# Altium project pca64142.PrjPCB
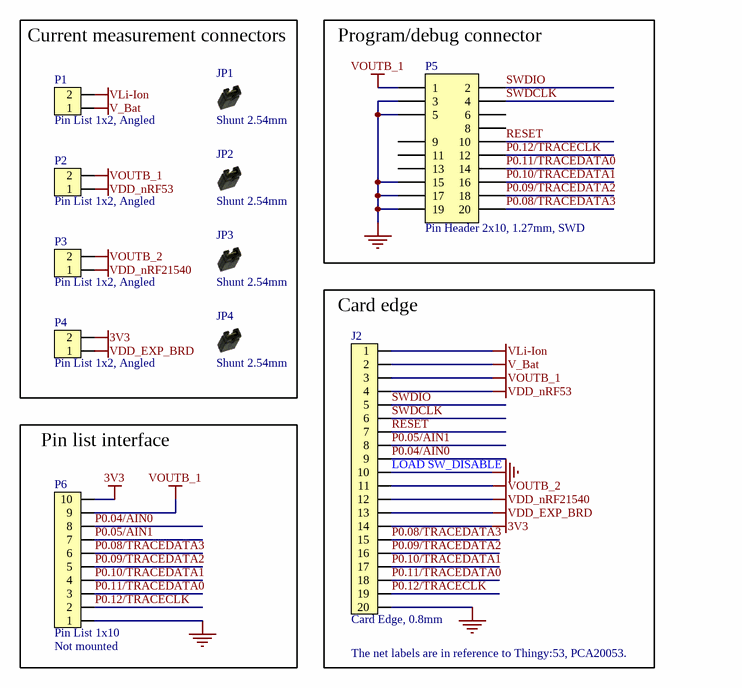
[diagram p0: pca64142.SchDoc]
SurfaceFinish: ENIG Gold; SoldermaskColor: Blue; SilkscreenColor: White; Revision: 1.0.1; ProjectNumber: PCA64142; ProjectName: Thingy:53; PCBStackup: 2004; PCBRevision: 0042MASI; PCBNumber: 400532; PCAName: PCA64142; Organization: Nordic Semiconductor; NrOfLayers: 2; LaminateMaterial: FR-4 Halogen Free; BoardTitle: Thingy53 Debug and Current Measurement Board; BoardThickness: 1.0mm; Author: MASI
1 sheet, 11 parts. Net scope: global (net labels, ports and power ports of the same name join across sheets).
Board file: 400532.PcbDoc

## Sheet pca64142.SchDoc: =BoardTitle
size A4; Organization: Nordic Semiconductor; Revision: 1.0.1; SheetNumber: 1; SheetTotal: 1; Author: MASI; CompanyName: Nordic Semiconductor; DrawnBy: MASI; ProjectName: Thingy:53

### Parts
J2  Card Edge, 0.8mm  [10056847-101LF Mating Board]  (no BOM)
JP1  Shunt 2.54mm  [Shunt_2.54mm_Horizontal]
JP2  Shunt 2.54mm  [Shunt_2.54mm_Horizontal]
JP3  Shunt 2.54mm  [Shunt_2.54mm_Horizontal]
JP4  Shunt 2.54mm  [Shunt_2.54mm_Horizontal]
P1  Pin List 1x2, Angled  [LIST_ANG_1x2-SMD-2.54MM]
P2  Pin List 1x2, Angled  [LIST_ANG_1x2-SMD-2.54MM]
P3  Pin List 1x2, Angled  [LIST_ANG_1x2-SMD-2.54MM]
P4  Pin List 1x2, Angled  [LIST_ANG_1x2-SMD-2.54MM]
P5  Pin Header 2x10, 1.27mm, SWD  [HDR_2x10-SMD-1.27mm-K-SWD]
P6  Pin List 1x10  Assembly: Not mounted  [LIST_1x10-NC]

### Blocks framed on the sheet
Current measurement connectors: JP1-JP4 P1-P4
Program/debug connector: P5
Card edge: J2
Pin list interface: P6

### Nets
3V3: J2.14 P4.2 P6.10
GND: J2.10 J2.20 P5.3 P5.5 P5.15 P5.17 P5.19 P6.1
V_Bat: J2.2 P1.1
VDD_EXP_BRD: J2.13 P4.1
VDD_nRF53: J2.4 P2.1
VDD_nRF21540: J2.12 P3.1
VLi-Ion: J2.1 P1.2
VOUTB_1: J2.3 P2.2 P5.1 P6.9
VOUTB_2: J2.11 P3.2
P0.04/AIN0: J2.9 P6.8
P0.05/AIN1: J2.8 P6.7
P0.08/TRACEDATA3: J2.15 P5.20 P6.6
P0.09/TRACEDATA2: J2.16 P5.18 P6.5
P0.10/TRACEDATA1: J2.17 P5.16 P6.4
P0.11/TRACEDATA0: J2.18 P5.14 P6.3
P0.12/TRACECLK: J2.19 P5.12 P6.2
RESET: J2.7 P5.10
SWDCLK: J2.6 P5.4
SWDIO: J2.5 P5.2

Not connected (* = marked no-connect by the designer): P5 6 8 9 11 13

### Notes on the sheet
- (near J2) LOAD SW_DISABLE
- (near J2) The net labels are in reference to Thingy:53, PCA20053.
- Title
- Size
- Date:
- A4
- Project Number
- Sheet         of
- Revision
- File:
- Drawn By:

### Library data of the parts
J2 = 10056847-101LF Mating Board: 0.8mm pitch, dual edge, card edge connector; Manufacturer: N.A.; Pad Count: 20; Part Number: 10056847-101LF Mating Board; Manufacturer Part Number: N.A.; Footprint Doc: 10056847-101LF Mating Board; LatestRevisionDate: 2018-05-09; Published: 2018-05-09; Value: Card Edge, 0.8mm; Note: N.A.; Artikkelnr Noca: N.A.; Part number IPS: N.A.; ComponentLink1URL: https://www.amphenol-icc.com/media/wysiwyg/files/drawing/10056847.pdf; ComponentLink1Description: Datasheet; ComponentLink2URL: N.A.; ComponentLink2Description: Supplier link; HelpURL: N.A.; Supplier 1: N.A.; Supplier Part Number 1: N.A.; Supplier 2: N.A.; Supplier Part Number 2: N.A.; PartId: 100500634; Component Class: Connectors
JP1-JP4 = SHUNT JUMPER 2.54mm Black Tin: Shunt Jumper 2.54mm Black, open top; Manufacturer: Samtec; Manufacturer Part Number: SNT-100-BK-T; Pad Count: 2; Note: SHUNT JUMPER .1" BLACK TIN, h=6.10mm, w=5.08mm; Artikkelnr Noca: N.A.; Part Number: SHUNT JUMPER 2.54mm Black Tin; Component Class: Connectors; ComponentLink1URL: N.A.; ComponentLink1Description: Datasheet; ComponentLink2URL: N.A.; ComponentLink2Description: Supplier link; HelpURL: http://suddendocs.samtec.com/catalog_english/snt.pdf; Footprint Doc: SHUNT JUMPER 2.54mm; LatestRevisionDate: 2021-06-28; Published: 2021-06-28; Value: Shunt 2.54mm; Supplier 1: Digi-Key; Supplier Part Number 1: SAM8860-ND; Supplier 2: Mouser; Supplier Part Number 2: 200-SNT100BKT; Part number IPS: N.A.; Author: masi; Part number Norautron: N.A.
P1-P4 = Pin List Ang 1x2 SMD, 2.54mm: Pin List 1x2, 2.54mm (100mil), Right Angled, SMD; Manufacturer: W-CON; Manufacturer Part Number: 1125B-1102S0Z135R2; Part number IPS: 00000009972; Note: N.A.; Artikkelnr Noca: 55010023; Pad Count: 2; Part Number: Pin List Ang 1x2 SMD, 2.54mm; Footprint Doc: LIST_ANG_1x2-SMD-2.54MM; LatestRevisionDate: 2016-05-26; Published: 2016-01-22; Value: Pin List 1x2, Angled; ComponentLink1URL: N.A.; ComponentLink1Description: Datasheet; ComponentLink2URL: N.A.; ComponentLink2Description: Supplier link; HelpURL: \\hizz\pro\app9717\Datasheet\connectors\W-CON\1125B-11XXXXZXXXXX.pdf; Supplier 1: Cabcon; Supplier Part Number 1: 1125B-1102S0Z135R2; Supplier 2: Samtec; Supplier Part Number 2: TSM-102-01-L-SH-A; PartId: 100500354; Component Class: Connectors
P5 = Pin Header 2x10 SMD, 1.27mm, KS, SWD: Pin Header 2x10, 1.27mm (50mil), SMD, Keying Shroud, Removed Pin 7; Manufacturer: W-CON; Manufacturer Part Number: 3132-20MS0BK00R1; Note: N.A.; Pad Count: 20; Part Number: Pin Header 2x10 SMD, 1.27mm, KS, SWD; ComponentLink1URL: N.A.; ComponentLink1Description: Datasheet; ComponentLink2URL: N.A.; ComponentLink2Description: Supplier link; HelpURL: N.A.; Footprint Doc: HDR_2x10-SMD-1.27mm-SWD; LatestRevisionDate: 2017-10-23; Published: 2014-05-23; Value: Pin Header 2x10, 1.27mm, SWD; Supplier 1: Cabcon; Supplier Part Number 1: 3132-20MS0BK00R1; Supplier 2: Digi-Key; Supplier Part Number 2: FTSH-110-01-F-DV-K-ND; Artikkelnr Noca: N.A.; Part number IPS: N.A.; Component Class: Connectors; PartId: 100500280
P6 = Pin List 1x10, N.C.: Pin List 1x10, 2.54mm (100mil); Manufacturer: N.A.; Pad Count: 10; Part Number: Pin List 1x10, N.C.; Manufacturer Part Number: N.A.; ComponentLink1URL: N.A.; ComponentLink1Description: Datasheet; ComponentLink2URL: N.A.; ComponentLink2Description: Supplier link; HelpURL: N.A.; Footprint Doc: LIST_1x10; LatestRevisionDate: 2017-10-23; Published: 2017-10-23; Value: Pin List 1x10; Note: N.A.; Supplier 1: N.A.; Supplier Part Number 1: N.A.; Supplier 2: N.A.; Supplier Part Number 2: N.A.; Artikkelnr Noca: N.A.; Part number IPS: N.A.; Component Class: Connectors; PartId: 100500336